# EAGLE schematic CHECON.PCB.Button (EAGLE 6.6.0)
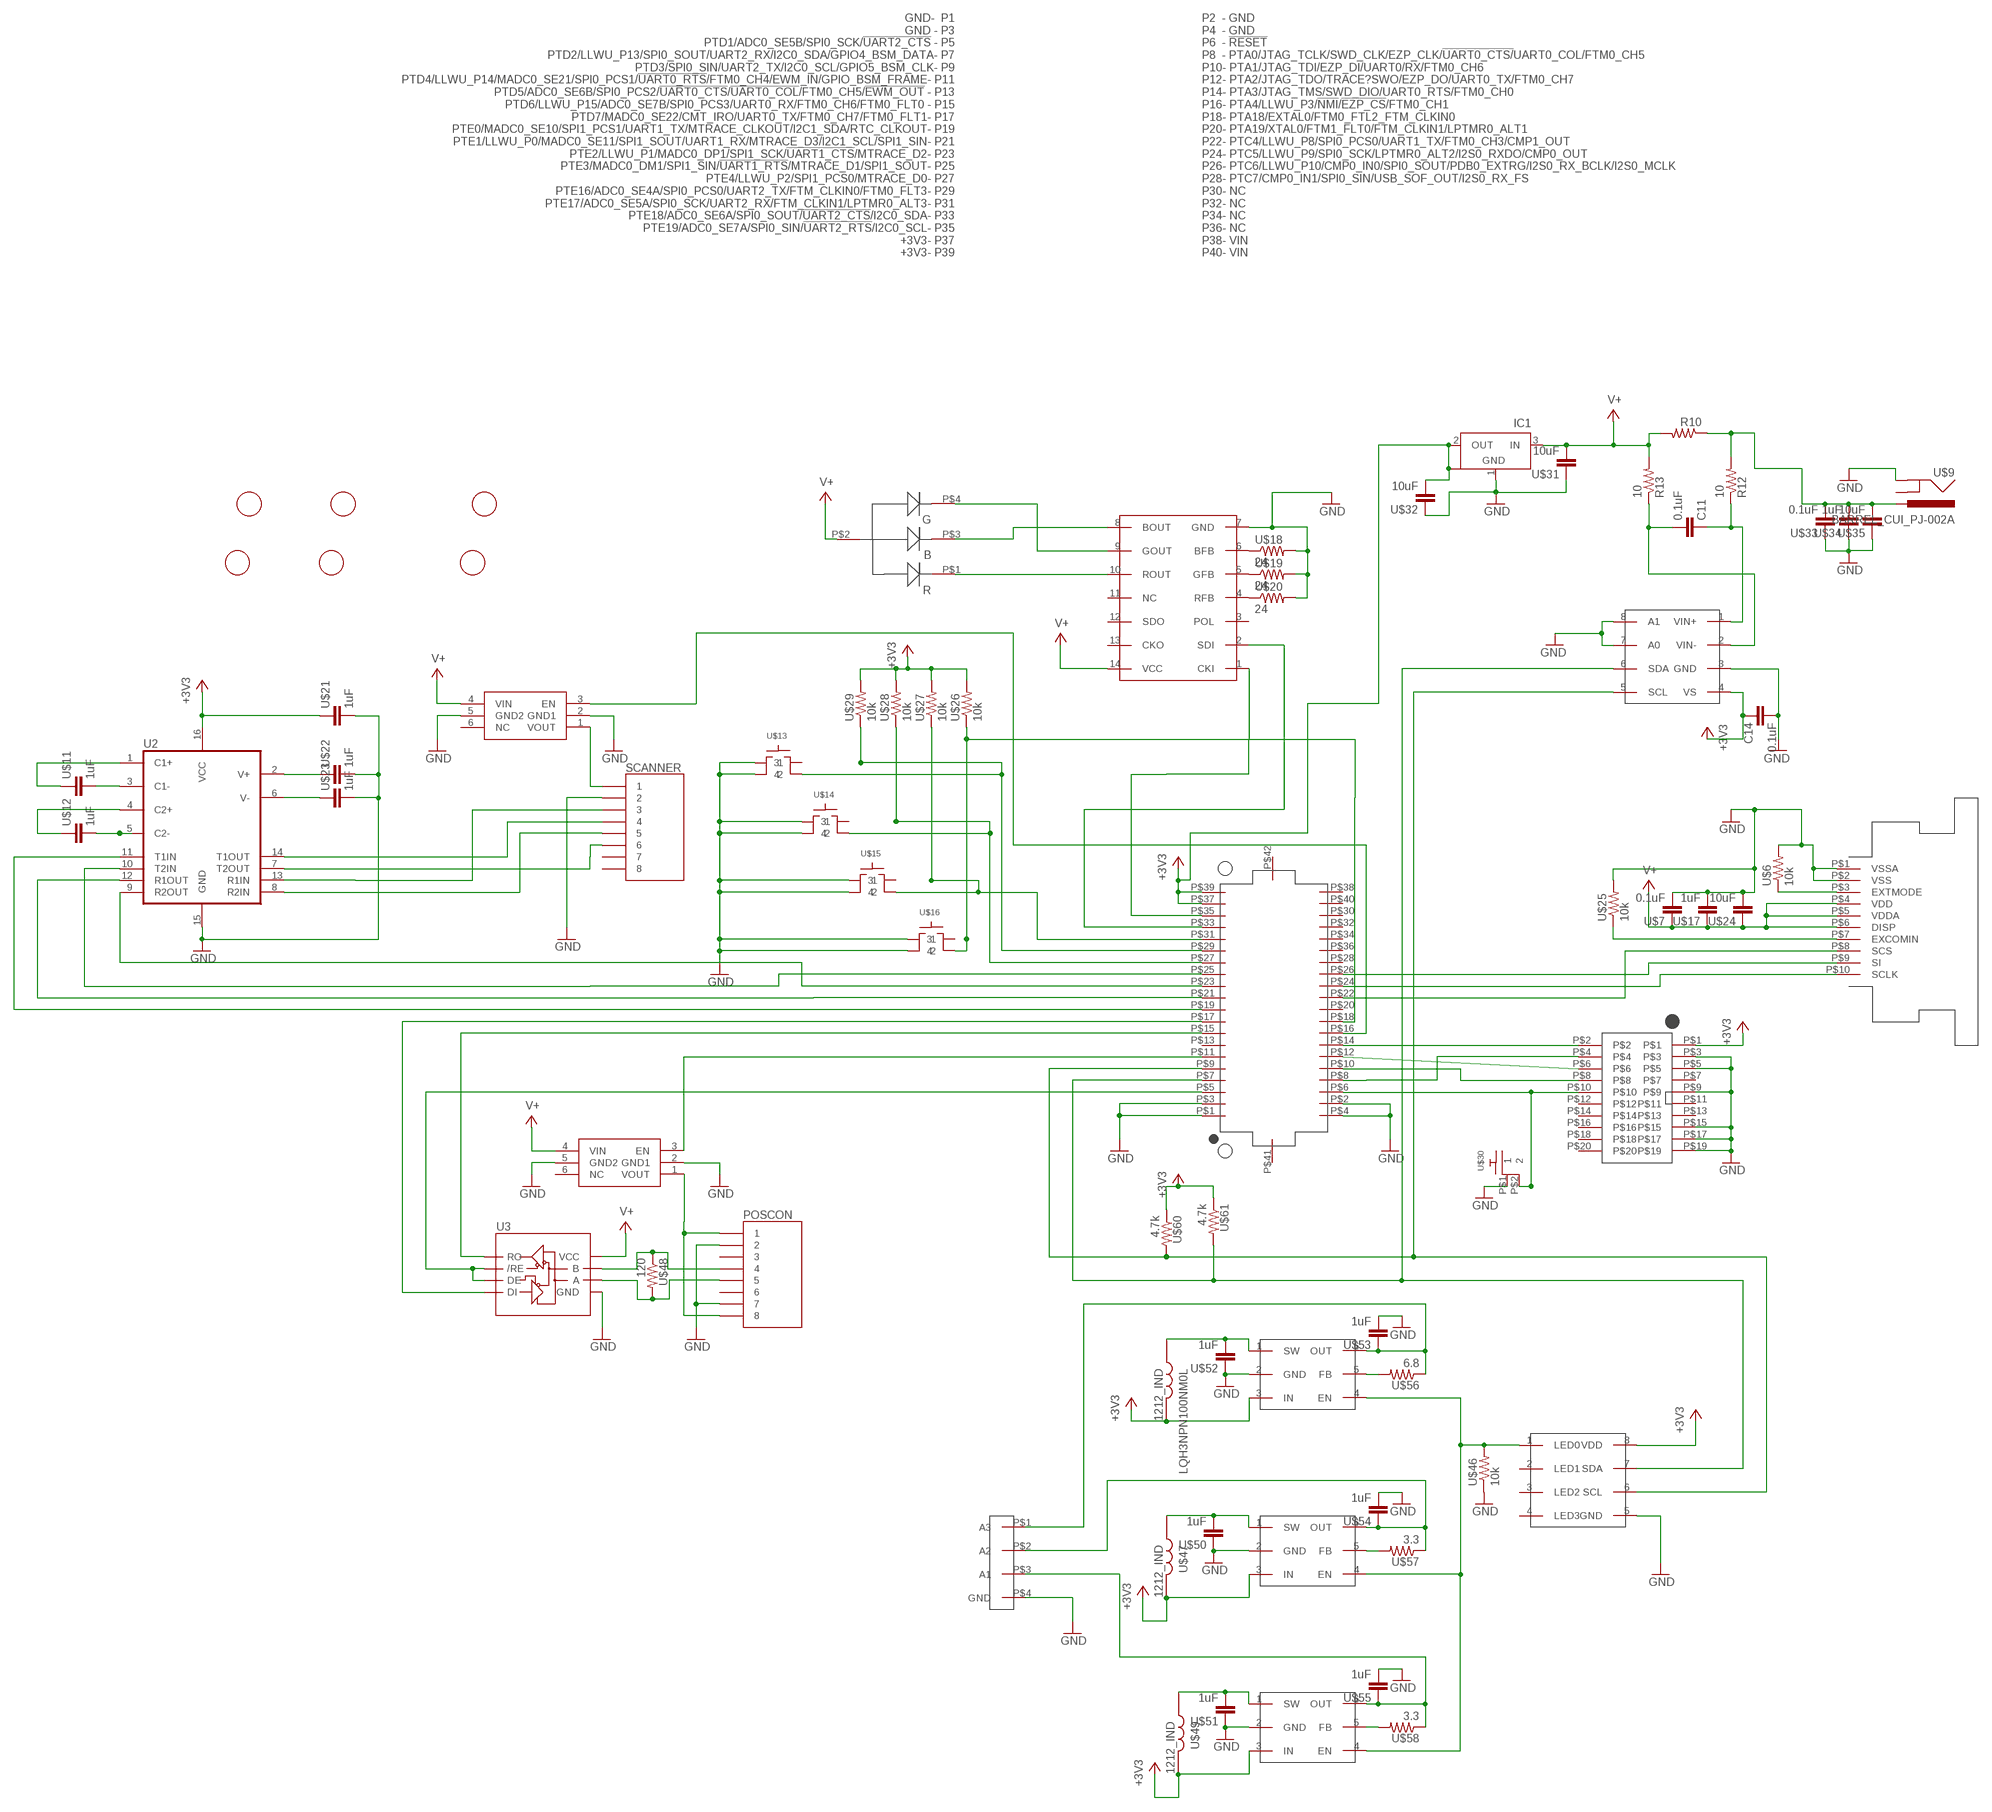
[diagram p0: schematic, sheet 1]

## Parts
C11  0.1uF  RF-C0805  [C0805]
C14  0.1uF  RF-C0805  [C0805]
IC1  NCP1117ST33T3G_1  [SOT223]
LQH3NPN100NM0L  1212_IND  [1212_IND]
POSCON  RJ45-8  [RJ45_SMD]
R10  RF-R2512  [R2512]
R12  10  RF-R0805  [RF-C0805]
R13  10  RF-R0805  [RF-C0805]
SCANNER  RJ45-8  [RJ45_SMD]
U2  MAX232SOIC16  [SO016]
U3  RS485SOIC  [SO08]
U$1  RGLBED  [RGBLED]
U$2  52745-1097  [52745-1097]
U$3  2X10JTAG  [2X10JTAG]
U$4  MIC94061C6  [SC70-6L]
U$5  MIC94061C6  [SC70-6L]
U$6  10k  RF-R0805  [RF-C0805]
U$7  0.1uF  RF-C0805  [C0805]
U$8  WS2801  [SO14]
U$9  BARREL_CUI_PJ-002A  [BARREL_CUI_PJ-002A]
U$10  KW2_CPU_COMBO  [BRAIN_COMBO]
U$11  1uF  RF-C0805  [C0805]
U$12  1uF  RF-C0805  [C0805]
U$13  SWITCH-TACTILE-FSM  [SWITCH-TACTILE-FSM]
U$14  SWITCH-TACTILE-FSM  [SWITCH-TACTILE-FSM]
U$15  SWITCH-TACTILE-FSM  [SWITCH-TACTILE-FSM]
U$16  SWITCH-TACTILE-FSM  [SWITCH-TACTILE-FSM]
U$17  1uF  RF-C0805  [C0805]
U$18  24  RF-R0805  [RF-C0805]
U$19  24  RF-R0805  [RF-C0805]
U$20  24  RF-R0805  [RF-C0805]
U$21  1uF  RF-C0805  [C0805]
U$22  1uF  RF-C0805  [C0805]
U$23  1uF  RF-C0805  [C0805]
U$24  10uF  RF-C0805  [C0805]
U$25  10k  RF-R0805  [RF-C0805]
U$26  10k  RF-R0805  [RF-C0805]
U$27  10k  RF-R0805  [RF-C0805]
U$28  10k  RF-R0805  [RF-C0805]
U$29  10k  RF-R0805  [RF-C0805]
U$30  RA_BUTTON  [RA_BUTTON]
U$31  10uF  RF-C0805  [C0805]
U$32  10uF  RF-C0805  [C0805]
U$33  0.1uF  RF-C0805  [C0805]
U$34  1uF  RF-C0805  [C0805]
U$35  10uF  RF-C0805  [C0805]
U$36  SC4541  [SOT23-6]
U$37  SC4541  [SOT23-6]
U$38  FIDUCIAL  [FIDUCIAL_1MM]
U$39  FIDUCIAL  [FIDUCIAL_1MM]
U$40  FIDUCIAL  [FIDUCIAL_1MM]
U$41  FIDUCIAL  [FIDUCIAL_1MM]
U$42  FIDUCIAL  [FIDUCIAL_1MM]
U$43  FIDUCIAL  [FIDUCIAL_1MM]
U$44  SC4541  [SOT23-6]
U$45  PCA9632DP1  [TSSOP-8]
U$46  10k  RF-R0805  [RF-C0805]
U$47  1212_IND  [1212_IND]
U$48  120  RF-R0805  [RF-C0805]
U$49  1212_IND  [1212_IND]
U$50  1uF  RF-C0805  [C0805]
U$51  1uF  RF-C0805  [C0805]
U$52  1uF  RF-C0805  [C0805]
U$53  1uF  RF-C0805  [C0805]
U$54  1uF  RF-C0805  [C0805]
U$55  1uF  RF-C0805  [C0805]
U$56  6.8  RF-R0805  [RF-C0805]
U$57  3.3  RF-R0805  [RF-C0805]
U$58  3.3  RF-R0805  [RF-C0805]
U$59  BL_CON  [009155004301006]
U$60  4.7k  RF-R0805  [RF-C0805]
U$61  4.7k  RF-R0805  [RF-C0805]
U$62  INA219B  [DCN-R-PDSO-G8]

## Nets
+3V3: C14.1 IC1.2(OUT) IC1.4(OUT1) LQH3NPN100NM0L.P$1 U2.16(VCC) U$3.P$1 U$10.P$37(+3V3) U$10.P$39(+3V3) U$21.1 U$26.2 U$27.2 U$28.2 U$29.2 U$32.2 U$36.3(IN) U$37.3(IN) U$44.3(IN) U$45.8(VDD) U$47.P$1 U$49.P$1 U$60.1 U$61.1 U$62.4(VS)
C1: U2.1(C1+) U$11.1
C2: U2.4(C2+) U$12.1
GND [GND]: C14.2 IC1.1(GND) POSCON.P$2 POSCON.P$7 SCANNER.P$2 U2.15(GND) U3.5(GND) U$2.P$1(VSSA) U$2.P$2(VSS) U$3.P$3 U$3.P$5 U$3.P$9 U$3.P$15 U$3.P$17 U$3.P$19 U$4.2(GND1) U$4.5(GND2) U$5.2(GND1) U$5.5(GND2) U$6.2 U$7.2 U$8.7(GND) U$9.P$2(GND) U$10.P$1(GND) U$10.P$2(GND) U$10.P$3(GND) U$10.P$4(GND) U$13.P$1 U$13.P$2 U$14.P$1 U$14.P$2 U$15.P$1 U$15.P$2 U$16.P$1 U$16.P$2 U$17.2 U$18.2 U$19.2 U$20.2 U$21.2 U$22.2 U$23.2 U$24.2 U$25.2 U$30.P$1 U$31.1 U$32.1 U$33.1 U$34.1 U$35.1 U$36.2(GND) U$37.2(GND) U$44.2(GND) U$45.5(GND) U$46.1 U$50.1 U$51.1 U$52.1 U$53.2 U$54.2 U$55.2 U$59.P$4(GND) U$62.3(GND) U$62.7(A0) U$62.8(A1)
N$1: U$3.P$2 U$10.P$14(PTA3/JTAG_TMS/SWD_DIO/UART0_RTS/FTM0_CH0)
N$2: U$3.P$6 U$10.P$12(PTA2/JTAG_TDO/TRACE?SWO/EZP_DO/UART0_TX/FTM0_CH7)
N$3: U$3.P$8 U$10.P$10(PTA1/JTAG_TDI/EZP_DI/UART0/RX/FTM0_CH6)
N$4: U$3.P$4 U$10.P$8(PTA0/JTAG_TCLK/SWD_CLK/EZP_CLK/!UART0_CTS/!UART0_COL/FTM0_CH5)
N$5: U$1.P$4(GREEN) U$8.9(GOUT)
N$6: U$3.P$10 U$10.P$6(!RESET) U$30.P$2
N$7: SCANNER.P$6 U2.7(T2OUT)
N$8: U$1.P$3(BLUE) U$8.8(BOUT)
N$9: U$1.P$1(RED) U$8.10(ROUT)
N$10 [GND]: U2.12(R1OUT) U$10.P$21(PTE1/LLWU_P0/MADC0_SE11/SPI1_SOUT/UART1_RX/MTRACE_D3/I2C1_SCL/SPI1_SIN)
N$11: U$8.1(CKI) U$10.P$35(PTE19/ADC0_SE7A/SPI0_SIN/!UART2_RTS!/I2C0_SCL)
N$12 [GND]: SCANNER.P$4 U2.14(T1OUT)
N$13: U$8.6(BFB) U$18.1
N$14: U$8.5(GFB) U$19.1
N$15: U$8.4(RFB) U$20.1
N$16: U$8.2(SDI) U$10.P$33(PTE18/ADC0_SE6A/SPI0_SOUT/!UART2_CTS!/I2C0_SDA)
N$17 [GND]: U3.1(RO) U$10.P$15(PTD6/LLWU_P15/ADC0_SE7B/SPI0_PCS3/UART0_RX/FTM0_CH6/FTM0_FLT0)
N$18: U2.3(C1-) U$11.2
N$19: POSCON.P$4 U3.7(B) U$48.1
N$20: POSCON.P$5 U3.6(A) U$48.2
N$21: U2.5(C2-) U$12.2
N$22: U2.6(V-) U$23.1
N$23: U2.2(V+) U$22.1
N$24: POSCON.P$1 POSCON.P$8 U$5.1(VOUT)
N$25 [GND]: SCANNER.P$1 U$4.1(VOUT)
N$26 [GND]: U2.11(T1IN) U$10.P$19(PTE0/MADC0_SE10/SPI1_PCS1/UART1_TX/MTRACE_CLKOUT/I2C1_SDA/RTC_CLKOUT)
N$27 [GND]: U3.4(DI) U$10.P$17(PTD7/MADC0_SE22/CMT_IRO/UART0_TX/FTM0_CH7/FTM0_FLT1)
N$28 [GND]: U3.2(/RE) U3.3(DE) U$10.P$5(PTD1/ADC0_SE5B/SPI0_SCK/!UART2_CTS)
N$29 [GND]: U$2.P$9(SI) U$10.P$26(PTC6/LLWU_P10/CMP0_IN0/SPI0_SOUT/PDB0_EXTRG/I2S0_RX_BCLK/I2S0_MCLK)
N$30 [GND]: U$2.P$10(SCLK) U$10.P$24(PTC5/LLWU_P8/SPI0_PCS0/UART1_TX/FTM0_CH3/CMP1_OUT)
N$31 [GND]: U$2.P$8(SCS) U$10.P$22(PTC4/LLWU_P8/SPI0_PCS0/UART1_TX/FTM0_CH3/CMP1_OUT)
N$32 [GND]: U$2.P$3(EXTMODE) U$6.1
N$33 [GND]: U$2.P$7(EXCOMIN) U$25.1
N$34: SCANNER.P$5 U2.8(R2IN)
N$35: U$10.P$31(PTE17/ADC0_SE5A/SPI0_SCK/UART2_RX/FTM_CLKIN1/LPTMR0_ALT3) U$15.P$4 U$27.1
N$36: U$10.P$27(PTE4/LLWU_P2/SPI1_PCS0/MTRACE_D0) U$14.P$4 U$28.1
N$37: U$10.P$29(PTE16/ADC0_SE4A/SPI0_PCS0/UART2_TX/FTM_CLKIN0/FTM0_FLT3) U$13.P$4 U$29.1
N$38: U2.9(R2OUT) U$10.P$23(PTE2/LLWU_P1/MADC0_DP1/SPI1_SCK/!UART1_CTS!/MTRACE_D2)
N$39: U$5.3(EN) U$10.P$11(PTD4/LLWU_P14/MADC0_SE21/SPI0_PCS1/!UART0_RTS!/FTM0_CH4/EWM_IN/GPIO_BSM_FRAME)
N$40: U$4.3(EN) U$10.P$16(PTA4/LLWU_P3/!NMI!/!EZP_CS!/FTM0_CH1)
N$41: U2.10(T2IN) U$10.P$25(PTE3/MADC0_DM1/SPI1_SIN/!UART1_RTS!/MTRACE_D1/SPI1_SOUT)
N$42: U$10.P$18(PTA18/EXTAL0/FTM0_FTL2_FTM_CLKIN0) U$16.P$4 U$26.1
N$43: U$36.4(EN) U$37.4(EN) U$44.4(EN) U$45.1(LED0) U$46.2
N$44: U$37.1(SW) U$47.P$2 U$50.2
N$45: U$10.P$7(PTD2/LLWU_P13/SPI0_SOUT/UART2_RX/I2C0_SDA/GPIO4_BSM_DATA) U$45.7(SDA) U$61.2 U$62.6(SDA)
N$46: LQH3NPN100NM0L.P$2 U$36.1(SW) U$52.2
N$47: U$10.P$9(PTD3/SPI0_SIN/UART2_TX/I2C0_SCL/GPIO5_BSM_CLK) U$45.6(SCL) U$60.2 U$62.5(SCL)
N$48: U$44.1(SW) U$49.P$2 U$51.2
N$49: R10.1 R12.2 U$9.P$1(PWR) U$33.2 U$34.2 U$35.2
N$50: U$44.5(FB) U$58.2
N$51: U$44.6(OUT) U$55.1 U$58.1 U$59.P$3(A1)
N$52: U$37.5(FB) U$57.2
N$53: U$37.6(OUT) U$54.1 U$57.1 U$59.P$2(A2)
N$54: U$36.6(OUT) U$53.1 U$56.1 U$59.P$1(A3)
N$55: U$36.5(FB) U$56.2
N$56: C11.1 R12.1 U$62.1(VIN+)
N$57: C11.2 R13.1 U$62.2(VIN-)
R1IN: SCANNER.P$3 U2.13(R1IN)
V+: IC1.3(IN) R10.2 R13.2 U3.8(VCC) U$1.P$2(ANODE) U$2.P$4(VDD) U$2.P$5(VDDA) U$2.P$6(DISP) U$4.4(VIN) U$5.4(VIN) U$7.1 U$8.14(VCC) U$17.1 U$24.1 U$31.2
Unconnected: POSCON.P$3 POSCON.P$6 SCANNER.P$7 SCANNER.P$8 U$3.P$7 U$3.P$11 U$3.P$12 U$3.P$13 U$3.P$14 U$3.P$16 U$3.P$18 U$3.P$20 U$4.6(NC) U$5.6(NC) U$8.3(POL) U$8.11(NC) U$8.12(SDO) U$8.13(CKO) U$9.P$3(GNDBREAK) U$10.P$13(PTD5/ADC0_SE6B/SPI0_PCS2/!UART0_CTS!/!UART0_COL!/FTM0_CH5/!EWM_OUT) U$10.P$20(PTA19/XTAL0/FTM1_FLT0/FTM_CLKIN1/LPTMR0_ALT1) U$10.P$28(PTC7/CMP0_IN1/SPI0_SIN/USB_SOF_OUT/I2S0_RX_FS) U$10.P$30(NC) U$10.P$32(NC) U$10.P$34(NC) U$10.P$36(NC) U$10.P$38(VIN) U$10.P$40(VIN) U$10.P$41 U$10.P$42 U$13.P$3 U$14.P$3 U$15.P$3 U$16.P$3 U$45.2(LED1) U$45.3(LED2) U$45.4(LED3)

## Library data of the parts
C11 C14 = GW-devices:RF-C: RF capacitor pads for FSL reference design
IC1 = KW2:NCP1117ST33T3G_1: VOLTAGE REGULATOR; MFGN: OnSemi; MFGP: NCP1117ST33T3G
LQH3NPN100NM0L U$47 U$49 = KW2:1212_IND; MFGN: Murata; MFGP: LQH3NPN100NM0L
POSCON SCANNER = GW-devices:RJ45-8: RJ45 Jack MFG part number 54602-908lf; MFGN: Molex; MFGP: 0955016889
R10 R12 R13 = GW-devices:RF-R: RF resistor pads for FSL reference design
U2 = SparkFun:MAX232: RS232 Transceiver Very common IC. This is generically called 'MAX232', but works with the 3V equivalent MAX3232 generic ICs. Field tested and mother approved. Spark Fun Electronics SKU : COM-00316 (DIP) and COM-00589 (SMD); MFGN: Texas Instruments; MFGP: MAX232DR; PRICE: 0.86
U3 = SparkFun:RS485; MFGN: Texas Instruments; MFGP: SN65HVD1781DR; PRICE: 4.29
U$1 = KW2:RGLBED
U$2 = KW2:52745-1097
U$3 = KW2:2X10JTAG
U$4 U$5 = GW-devices:MIC94061; MFGN: Micrel; MFGP: MIC94061YC6 TR; PRICE: 1.50
U$6 U$25-U$29 U$46 = GW-devices:RF-R: RF resistor pads for FSL reference design; MFGN: Vishay Dale; MFGP: CRCW080510K0FKEA
U$7 U$33 = GW-devices:RF-C: RF capacitor pads for FSL reference design; MFGN: TDK; MFGP: C2012X5R1H104K085AA
U$8 = GW-devices:WS2801; MFGN: WorldSemi; MFGP: WS2801
U$9 = KW2:BARREL_CUI_PJ-002A
U$10 = KW2:KW2_CPU
U$11 U$12 U$17 U$21-U$23 U$34 U$50-U$55 = GW-devices:RF-C: RF capacitor pads for FSL reference design; MFGN: TDK; MFGP: C2012X5R1E105K125AA
U$13-U$16 = GW-devices:SWITCH-TACTILE; MFGN: E-Switch; MFGP: TL3301DF160QG
U$18-U$20 = GW-devices:RF-R: RF resistor pads for FSL reference design; MFGN: Vishay Dale; MFGP: CRCW080524R0FKEA
U$24 U$31 U$32 U$35 = GW-devices:RF-C: RF capacitor pads for FSL reference design; MFGN: Murata; MFGP: GRM219R61E106KA12D
U$30 = KW2:RA_BUTTON
U$36 U$37 U$44 = KW2:SC4541; MFGN: Semtech; MFGP: SC4541
U$38-U$43 = adafruit:FIDUCIAL: For use by pick and place machines to calibrate the vision/machine, 1mm By microbuilder.eu; NOTES: DNP
U$45 = KW2:PCA9632DP1; MFGN: NXP; MFGP: PCA9632DP1
U$48 U$60 U$61 = GW-devices:RF-R: RF resistor pads for FSL reference design; MFGN: Panasonic; MFGP: ERJ-6ENF4701V
U$56 = GW-devices:RF-R: RF resistor pads for FSL reference design; MFGN: Yageo; MFGP: RC0805FR-076R8L
U$57 U$58 = GW-devices:RF-R: RF resistor pads for FSL reference design; MFGN: Samsung; MFGP: RC2012F3R3CS
U$59 = KW2:BL_CON; MFGN: AVX; MFGP: 009155004301006
U$62 = KW2:INA219B; MFGN: Texas Instruments; MFGP: INA219B